# Altium project AutomatskoOsvetljenje.PrjPcb
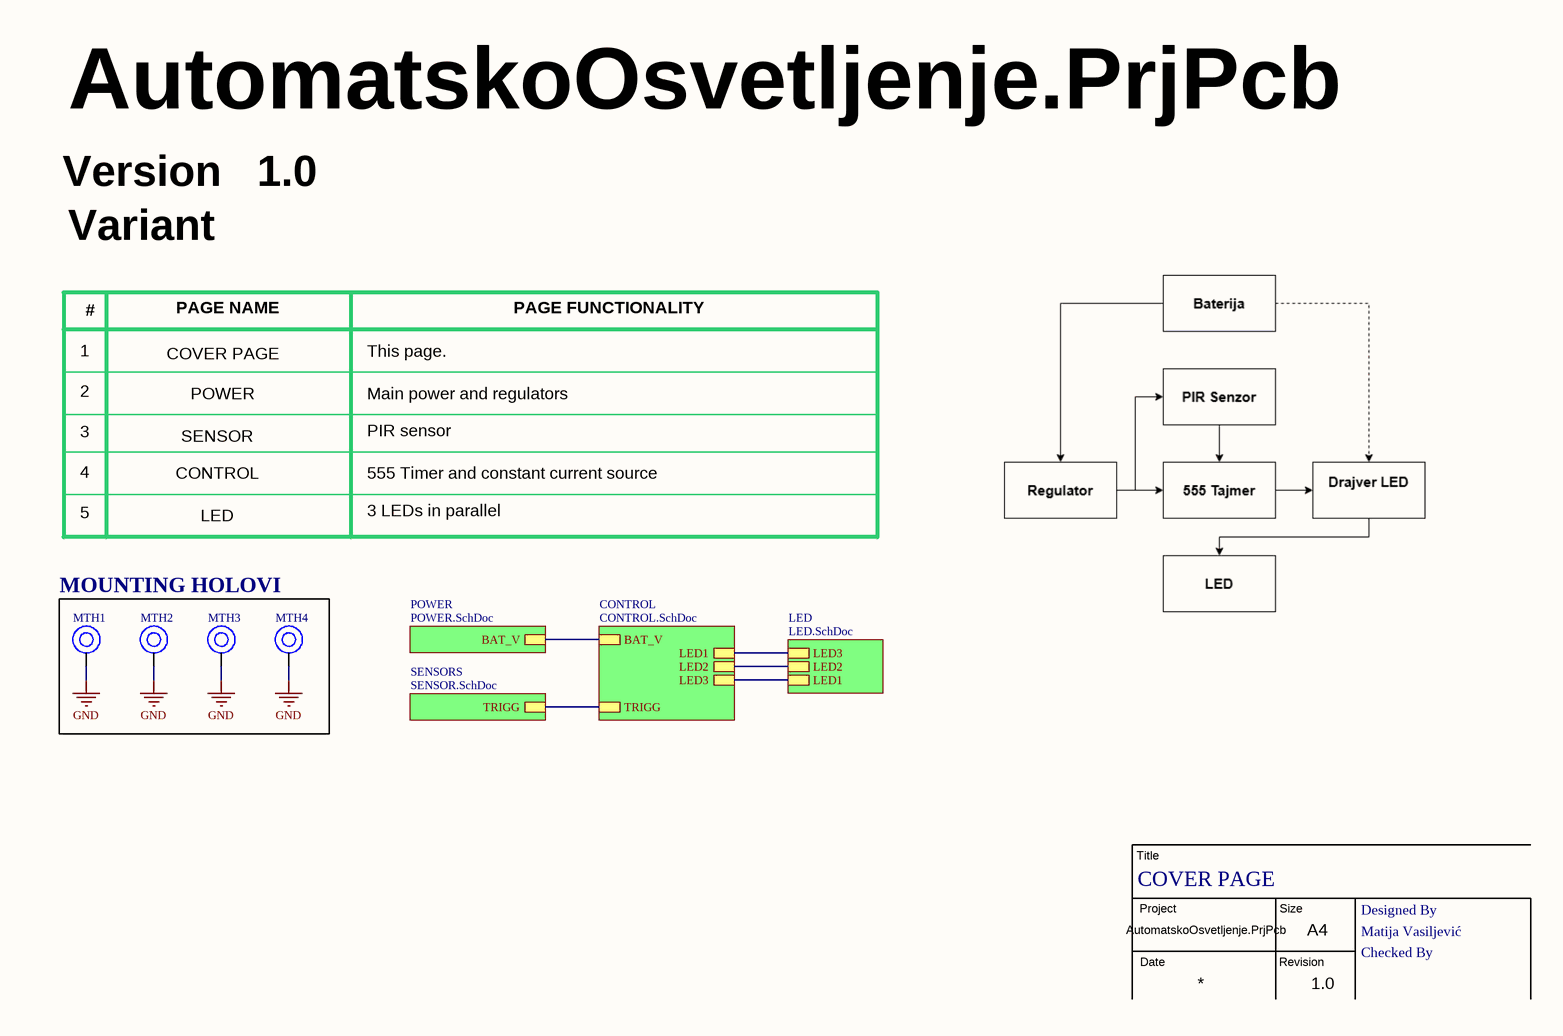
[diagram p0: COVER PAGE.SchDoc]
Engineer_Name: Matija Vasiljević; Global_version: 1.0
5 sheets, 69 parts. Net scope: hierarchical (ports join the sheet entries above them; power ports are global).
Board file: AutomatskoOsetljenjeV2.PcbDoc
Sheets:
  COVER PAGE.SchDoc
    CONTROL = CONTROL.SchDoc
    LED = LED.SchDoc
    POWER = POWER.SchDoc
    SENSORS = SENSOR.SchDoc

## Sheet COVER PAGE.SchDoc: COVER PAGE
size A4; SheetNumber: 1; SheetTotal: 5

### Parts
MTH1  MTH  [MOUNTING_HOLE_M3]  (value not drawn)  (no BOM)
MTH2  MTH  [MOUNTING_HOLE_M3]  (value not drawn)  (no BOM)
MTH3  MTH  [MOUNTING_HOLE_M3]  (value not drawn)  (no BOM)
MTH4  MTH  [MOUNTING_HOLE_M3]  (value not drawn)  (no BOM)

### Blocks framed on the sheet
MOUNTING HOLOVI: MTH1-MTH4

### Sub-sheets
CONTROL = CONTROL.SchDoc: BAT_V, TRIGG, LED1, LED2, LED3
LED = LED.SchDoc: LED1, LED2, LED3
POWER = POWER.SchDoc: BAT_V
SENSORS = SENSOR.SchDoc: TRIGG

### Nets
GND: MTH1.1 MTH2.1 MTH3.1 MTH4.1
NetLED3_2: sheet CONTROL/LED1, sheet LED/LED3
NetLED4_2: sheet CONTROL/LED2, sheet LED/LED2
NetLED5_2: sheet CONTROL/LED3, sheet LED/LED1
NetQ1_3: sheet CONTROL/TRIGG, sheet SENSORS/TRIGG
NetR11_2: sheet CONTROL/BAT_V, sheet POWER/BAT_V

### Notes on the sheet
- Variant
- Version
- #
- PAGE NAME
- PAGE FUNCTIONALITY
- 1
- COVER PAGE
- This page.
- 2
- 3
- SENSOR
- POWER
- Main power and regulators
- PIR sensor
- 4
- 5
- CONTROL
- LED
- 555 Timer and constant current source
- 3 LEDs in parallel
- Title
- Project
- Size
- Designed By
- Date
- Revision
- A4
- Checked By

### Library data of the parts
MTH1-MTH4 = MTH: Mounting hole; MPN: *

## Sheet CONTROL.SchDoc: CONTROL
size A4; SheetNumber: 4; SheetTotal: 5
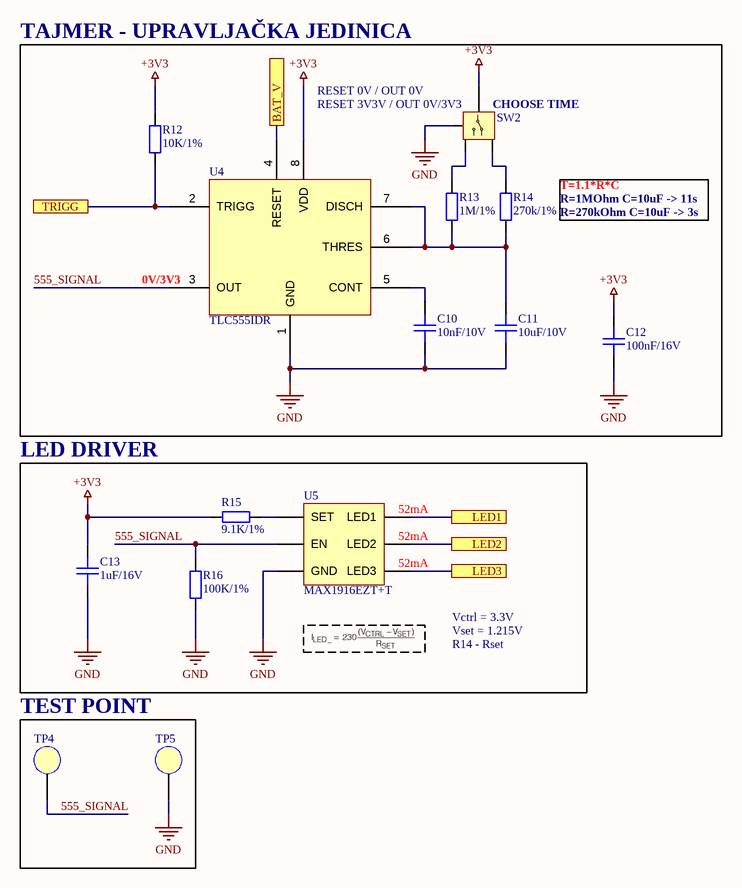
[diagram p1: CONTROL.SchDoc]

### Parts
C10  10nF/10V  [CAP_0603]
C11  10uF/10V  [CAP_0603]
C12  100nF/16V  [CAP_0603]
C13  1uF/16V  [CAP_0603]
R12  10K/1%  [RES_0603]
R13  1M/1%  [RES_0603]
R14  270k/1%  [RES_0603]
R15  9.1K/1%  [RES_0603]
R16  100K/1%  [RES_0603]
SW2  SWITCH_MAIN  [SWITCH_SK-12F17-G_HORIZONTAL]  (value not drawn)
TP4  TESTPOINT  [TESTPOINT]  (value not drawn)
TP5  TESTPOINT  [TESTPOINT]  (value not drawn)
U4  TLC555IDR  [8-SOIC]
U5  MAX1916EZT+T  [SOT23-6]

### Blocks framed on the sheet
TAJMER - UPRAVLJAČKA JEDINICA: C10-C12 R12-R14 SW2 U4
LED DRIVER: C13 R15 R16 U5
TEST POINT: TP4 TP5

### Ports
BAT_V, LED1, LED2, LED3, TRIGG

### Nets
+3V3: C12.2 C13.2 R12.2 R15.1 SW2.1(1P) U4.8(VDD)
GND: C10.1 C11.1 C12.1 C13.1 R16.1 SW2.4(GND) TP5.1(TP) U4.1(GND) U5.2(GND)
555_SIGNAL: R16.2 TP4.1(TP) U4.3(OUT) U5.1(EN)
NetC10_2: C10.2 U4.5(CONT)
NetC11_2: C11.2 R13.1 R14.1 U4.6(THRES) U4.7(DISCH)
NetLED3_2: U5.6(LED1) ; port LED1
NetLED4_2: U5.5(LED2) ; port LED2
NetLED5_2: U5.4(LED3) ; port LED3
NetQ1_3: R12.1 U4.2(TRIGG) ; port TRIGG
NetR11_2: U4.4(RESET) ; port BAT_V
NetR13_2: R13.2 SW2.2(2T)
NetR14_2: R14.2 SW2.3(3T)
NetR15_2: R15.2 U5.3(SET)

### Notes on the sheet
- (near SW2) RESET 0V / OUT 0V
- (near SW2) RESET 3V3V / OUT 0V/3V3
- (near SW2) CHOOSE TIME
- T=1.1*R*C
- R=1MOhm C=10uF -> 11s
- R=270kOhm C=10uF -> 3s
- (near U4) 0V/3V3
- (near U5) 52mA
- Vctrl = 3.3V
- Vset = 1.215V
- R14 - Rset
- Title
- Project
- Size
- Designed By
- Date
- Revision
- A4
- Checked By

### Library data of the parts
C10 = 10nF/10V: 10000 pF ±10% 50V Ceramic Capacitor X7R 0603 (1608 Metric); MPN: 0603B103K500CT
C11 = 10uF/10V: 10 µF ±10% 10V Ceramic Capacitor X5R 0603 (1608 Metric); MPN: CL10A106KP8NNNC
C12 = 100nF/16V: 0.1 µF ±10% 16V Ceramic Capacitor X7R 0603 (1608 Metric); MPN: CC0603KRX7R7BB104
C13 = 1uF/16V: 1 µF ±5% 16V Ceramic Capacitor X7R 0603 (1608 Metric); MPN: 0603YC105JAT2A
R12 = 10K/1%: 10 kOhms ±1% 0.1W, 1/10W Chip Resistor 0603 (1608 Metric) Moisture Resistant Thick Film; MPN: CR0603-FX-1002ELF
R13 = 1M/1%: 1 MOhms ±1% 0.1W, 1/10W Chip Resistor 0603 (1608 Metric) Automotive AEC-Q200 Thick Film; MPN: RMCF0603FT1M00
R14 = 270k/1%: 270 kOhms ±1% 0.1W, 1/10W Chip Resistor 0603 (1608 Metric) Automotive AEC-Q200 Thick Film; MPN: ERJ-3EKF2703V
R15 = 9.1K/1%: 9.1 kOhms ±1% 0.1W, 1/10W Chip Resistor 0603 (1608 Metric) Thick Film; MPN: CRCW06039K10FKEAC
R16 = 100K/1%: 100 kOhms ±1% 0.1W, 1/10W Chip Resistor 0603 (1608 Metric) Automotive AEC-Q200 Thick Film; MPN: ERJ-3EKF1003V
SW2 = SWITCH_MAIN: SWITCH SLIDE SPDT 300MA 30V; MPN: SK-12F17-G 7
TP4 TP5 = TESTPOINT: White PC Test Point, Miniature Phosphor Bronze Silver Plating Through Hole Mounting Type; MPN: 5002
U4 = TLC555IDR: 555 Type, Timer/Oscillator (Single) IC 2.1MHz 8-SOIC; MPN: TLC555IDR
U5 = LED DRIVER MAX1916: LED Driver IC 3 Output Linear Dimming 60mA TSOT-23-6; MPN: MAX1916EZT+T

## Sheet LED.SchDoc: LED
size A4; SheetNumber: 5; SheetTotal: 5
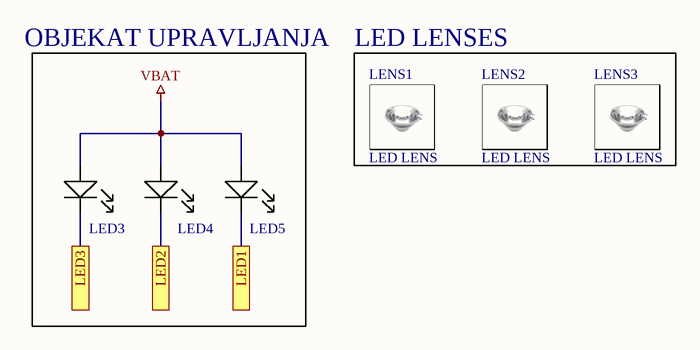
[diagram p2: LED.SchDoc]

### Parts
LED3  JB2835BWT-N-U65EA0000-N000P001  [LED_1411]  (value not drawn)
LED4  JB2835BWT-N-U65EA0000-N000P001  [LED_1411]  (value not drawn)
LED5  JB2835BWT-N-U65EA0000-N000P001  [LED_1411]  (value not drawn)
LENS1  LED LENS  (net tie)
LENS2  LED LENS  (net tie)
LENS3  LED LENS  (net tie)

### Blocks framed on the sheet
LED LENSES: LENS1-LENS3

### Ports
LED1, LED2, LED3

### Nets
VBAT: LED3.1(Anode) LED4.1(Anode) LED5.1(Anode)
NetLED3_2: LED3.2(Cathode) ; port LED3
NetLED4_2: LED4.2(Cathode) ; port LED2
NetLED5_2: LED5.2(Cathode) ; port LED1

### Notes on the sheet
- OBJEKAT UPRAVLJANJA
- Title
- Project
- Size
- Designed By
- Date
- Revision
- A4
- Checked By

### Library data of the parts
LED3-LED5 = LED COOL WHITE: LED Lighting J White, Cool 6500K 3-Step MacAdam Ellipse 2.7V 55mA 120° 1411 (3528 Metric); MPN: JB2835BWT-N-U65EA0000-N000P001
LENS1-LENS3 = LED LENS: LENS CLR 15-33DEG MEDIUM SNAP-IN; MPN: 10003/15

## Sheet POWER.SchDoc: POWER
size A4; SheetNumber: 2; SheetTotal: 5
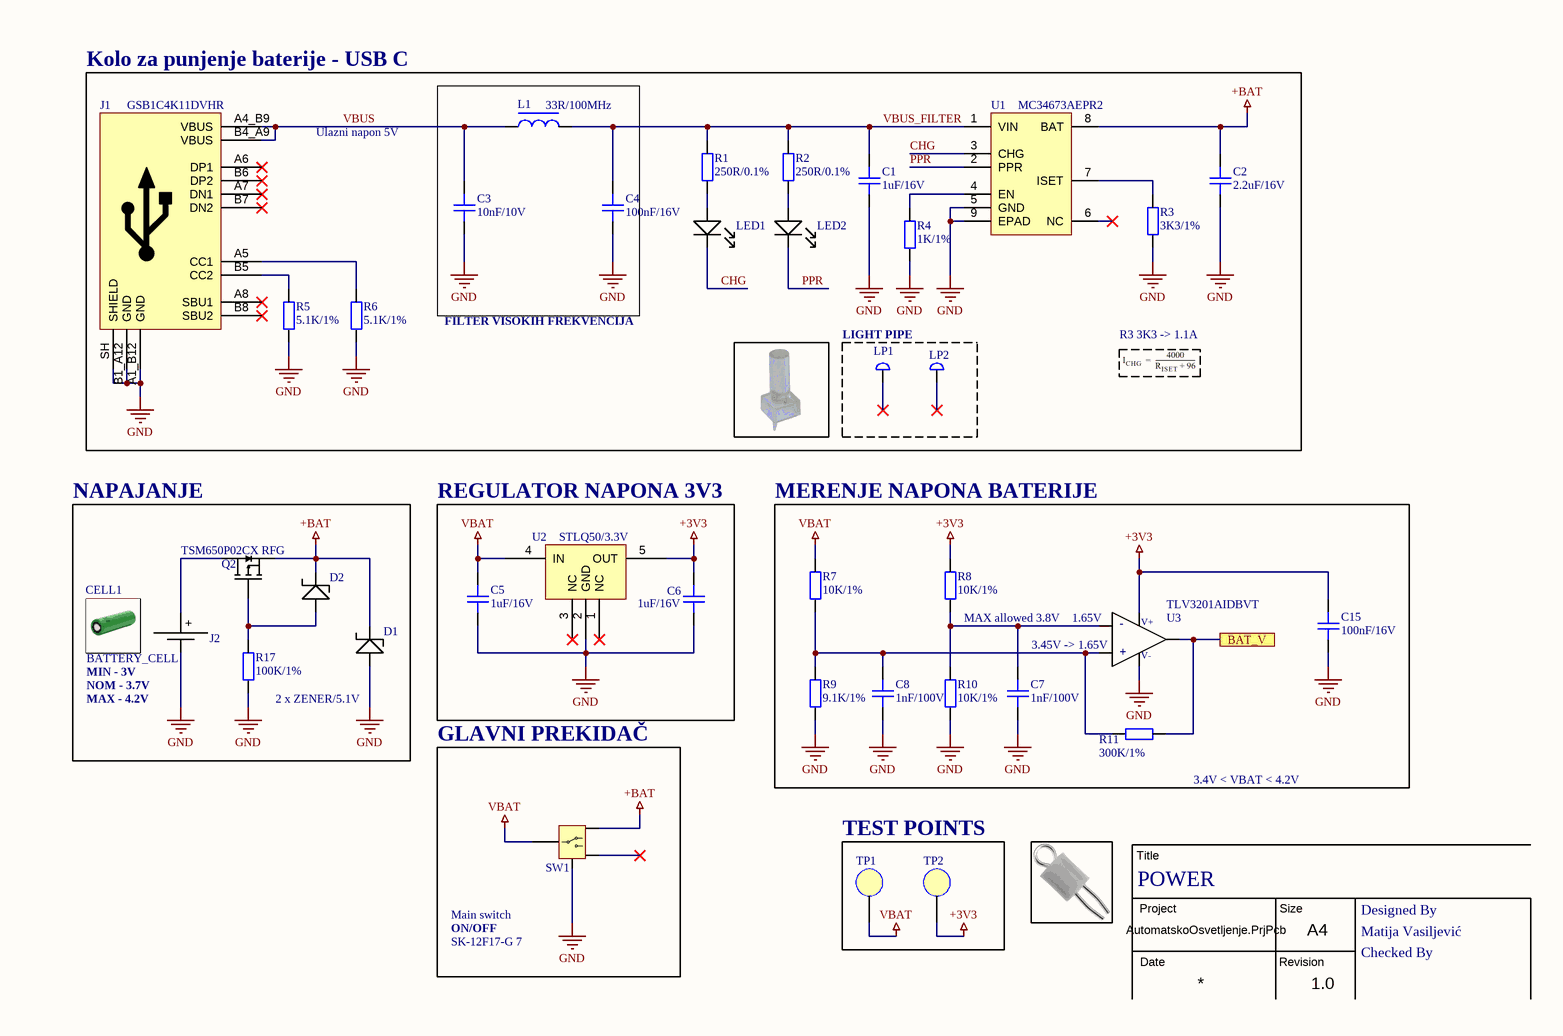
[diagram p3: POWER.SchDoc]

### Parts
C1  1uF/16V  [CAP_0603]
C2  2.2uF/16V  [CAP_0603]
C3  10nF/10V  [CAP_0603]
C4  100nF/16V  [CAP_0603]
C5  1uF/16V  [CAP_0603]
C6  1uF/16V  [CAP_0603]
C7  1nF/100V  [CAP_0603]
C8  1nF/100V  [CAP_0603]
C15  100nF/16V  [CAP_0603]
CELL1  BATTERY_CELL  (mechanical)
D1  ZENER/5.1V  [ZENER_SMA]  (value not drawn)
D2  2 x ZENER/5.1V  [ZENER_SMA]
J1  GSB1C4K11DVHR  [USBC_GSB1C4K11DVHR]
J2  12BHC186CLP-GR  [BATTERY_HOLDER_18650]  (value not drawn)
L1  33R/100MHz  [INDC_0603]
LED1  150060RS75000  [LED_0603]  (value not drawn)
LED2  150060VS75000  [LED_0603]  (value not drawn)
LP1  LIGHT_PIPE  [LIGHT_PIPE_VLP-400-F]  (value not drawn)
LP2  LIGHT_PIPE  [LIGHT_PIPE_VLP-400-F]  (value not drawn)
Q2  TSM650P02CX RFG  [SOT23-3]
R1  250R/0.1%  [RES_0603]
R2  250R/0.1%  [RES_0603]
R3  3K3/1%  [RES_0603]
R4  1K/1%  [RES_0603]
R5  5.1K/1%  [RES_0603]
R6  5.1K/1%  [RES_0603]
R7  10K/1%  [RES_0603]
R8  10K/1%  [RES_0603]
R9  9.1K/1%  [RES_0603]
R10  10K/1%  [RES_0603]
R11  300K/1%  [RES_0603]
R17  100K/1%  [RES_0603]
SW1  SK-12F17-G 7  [SWITCH_SK-12F17-G_HORIZONTAL]
TP1  TESTPOINT  [TESTPOINT]  (value not drawn)
TP2  TESTPOINT  [TESTPOINT]  (value not drawn)
U1  MC34673AEPR2  [UDFN 8]
U2  STLQ50/3.3V  [SOT323-5]
U3  TLV3201AIDBVT  [SOT23-5]

### Blocks framed on the sheet
Kolo za punjenje baterije - USB C: C1-C4 J1 L1 LED1 LED2 R1-R6 U1
LIGHT PIPE: LP1 LP2
NAPAJANJE: CELL1 D1 D2 J2 Q2 R17
REGULATOR NAPONA 3V3: C5 C6 U2
MERENJE NAPONA BATERIJE: C7 C8 C15 R7-R11 U3
GLAVNI PREKIDAČ: SW1
TEST POINTS: TP1 TP2

### Ports
BAT_V

### Nets
+3V3: C6.2 C15.2 R8.2 TP2.1(TP) U2.5(OUT) U3.5(+VDD)
+BAT: C2.2 D1.2(Cathode) D2.2(Cathode) Q2.2 SW1.3(3T) U1.8(BAT)
GND: C1.1 C2.1 C3.1 C4.1 C5.1 C6.1 C7.1 C8.1 C15.1 D1.1(Anode) J1.A1_B12(GND) J1.B1_A12(GND) J1.SH(SHIELD) J2.2(-) R3.1 R4.1 R5.1 R6.1 R9.1 R10.1 R17.1 SW1.4(GND) U1.5(GND) U1.9(EPAD) U2.2(GND) U3.2(-VDD)
VBAT: C5.2 R7.2 SW1.1(1P) TP1.1(TP) U2.4(IN)
CHG: LED1.2(Cathode) U1.3(CHG)
PPR: LED2.2(Cathode) U1.2(PPR)
VBUS: C3.2 J1.A4_B9(VBUS) J1.B4_A9(VBUS) L1.1
VBUS_FILTER: C1.2 C4.2 L1.2 R1.2 R2.2 U1.1(VIN)
NetC7_2: C7.2 R8.1 R10.2 U3.4(-)
NetC8_2: C8.2 R7.1 R9.2 R11.1 U3.3(+)
NetD2_1: D2.1(Anode) Q2.1 R17.2
NetJ1_A5: J1.A5(CC1) R6.2
NetJ1_B5: J1.B5(CC2) R5.2
NetJ2_1: J2.1(+) Q2.3
NetLED1_1: LED1.1(Anode) R1.1
NetLED2_1: LED2.1(Anode) R2.1
NetR3_2: R3.2 U1.7(ISET)
NetR4_2: R4.2 U1.4(EN)
NetR11_2: R11.2 U3.1(OUT) ; port BAT_V

Not connected (* = marked no-connect by the designer): J1 A6(DP1)* A7(DN1)* A8(SBU1)* B6(DP2)* B7(DN2)* B8(SBU2)*; LP1 1*; LP2 1*; SW1 2(2T)*; U1 6(NC)*; U2 1(NC)* 3(NC)*

### Notes on the sheet
- Ulazni napon 5V
- FILTER VISOKIH FREKVENCIJA
- R3 3K3 -> 1.1A
- (near R8) MAX allowed 3.8V
- (near U3) 3.45V -> 1.65V
- (near U3) 1.65V
- MIN - 3V
- NOM - 3.7V
- MAX - 4.2V
- 3.4V < VBAT < 4.2V
- Main switch
- ON/OFF
- Title
- Project
- Size
- Designed By
- Date
- Revision
- A4
- Checked By
- (in symbol TLV3201AIDBVT_COMPARATOR) V+; V-

### Library data of the parts
C1 C5 C6 = 1uF/16V: as C13 on sheet CONTROL
C2 = 2.2uF/16V: 2.2 µF ±10% 16V Ceramic Capacitor X7S 0603 (1608 Metric); MPN: GRM188C71C225KE11D
C3 = 10nF/10V: as C10 on sheet CONTROL
C4 C15 = 100nF/16V: as C12 on sheet CONTROL
C7 C8 = 1nF/100V: 1 µF ±10% 10V Ceramic Capacitor X7R 0603 (1608 Metric); MPN: CL10B105KP8NNNC
CELL1 = BATTERY_CELL: CELL 18650 SAMSUNG 3200mAh; MPN: *
D1 D2 = ZENER/5.1V: Zener Diode 5.1 V 1.5 W ±5% Surface Mount SMA; MPN: 1SMA5918BT3G
J1 = USB_C_GSB1C4K11DVHR: USB-C (USB TYPE-C) USB 2.0 Receptacle Connector 24 (16+8 Dummy) Position Through Hole, Right Angle; MPN: GSB1C4K11DVHR
J2 = BATTERY_HOLDER_18650: Cylindrical Battery Contacts, Clips, Holders & Springs 18650 Holder Board Mount Clip; MPN: 12BHC186CLP-GR
L1 = 33R/100MHz: 33 Ohms @ 100 MHz 1 Power Line Ferrite Bead 0603 (1608 Metric) 3A 25mOhm; MPN: BLM18PG330SN1DBLM18PG330SN1D
LED1 = INDICATION_LED_RED_1500_1: Red 625nm LED Indication - Discrete 2V 0603 (1608 Metric); MPN: 150060RS75000
LED2 = INDICATION_LED_GREEN_1500: Green 570nm LED Indication - Discrete 2V 0603 (1608 Metric); MPN: 150060VS75000
LP1 LP2 = LIGHT_PIPE: Light pipe for indication led; MPN: VLP-400-F
Q2 = TSM650P02CX RFG PMOS: P-Channel 20 V 4.1A (Tc) 1.56W (Tc) Surface Mount SOT-23; MPN: TSM650P02CX RFG
R1 R2 = 250R/0.1%: 250 Ohms ±0.1% 0.1W, 1/10W Chip Resistor 0603 (1608 Metric) Thin Film; MPN: RT0603BRE07250RL
R3 = 3K3/1%: 3.3 kOhms ±1% 0.1W, 1/10W Chip Resistor 0603 (1608 Metric) Automotive AEC-Q200 Thick Film; MPN: RMCF0603FT3K30
R4 = 1K/1%: 1 kOhms ±1% 0.1W, 1/10W Chip Resistor 0603 (1608 Metric) Moisture Resistant Thick Film; MPN: RC0603FR-071KL
R5 R6 = 5.1K/1%: 5.1 kOhms ±1% 0.1W, 1/10W Chip Resistor 0603 (1608 Metric) Moisture Resistant Thick Film; MPN: RC0603FR-075K1L
R7 R8 R10 = 10K/1%: as R12 on sheet CONTROL
R9 = 9.1K/1%: as R15 on sheet CONTROL
R11 = 300K/1%: 300 kOhms ±1% 0.1W, 1/10W Chip Resistor 0603 (1608 Metric) Automotive AEC-Q200 Thick Film; MPN: RMCF0603FT300K
R17 = 100K/1%: as R16 on sheet CONTROL
SW1 = SWITCH_MAIN: SWITCH SLIDE SPDT 300MA 30V; MPN: SK-12F17-G 7
TP1 TP2 = TESTPOINT: as TP4 on sheet CONTROL
U1 = MC34673AEPR2: Charger IC Lithium Ion/Polymer 8-UDFN (3x2); MPN: MC34673AEPR2
U2 = REG-STLQ50/3.3V: IC REG LINEAR 3.3V 50MA SOT323-5; MPN: STLQ50C33R
U3 = TLV3201AIDBVT_COMPARATOR: Comparator General Purpose Push-Pull SOT-23-5; MPN: TLV3201AIDBVT

## Sheet SENSOR.SchDoc: SENSOR
size A4; SheetNumber: 3; SheetTotal: 5
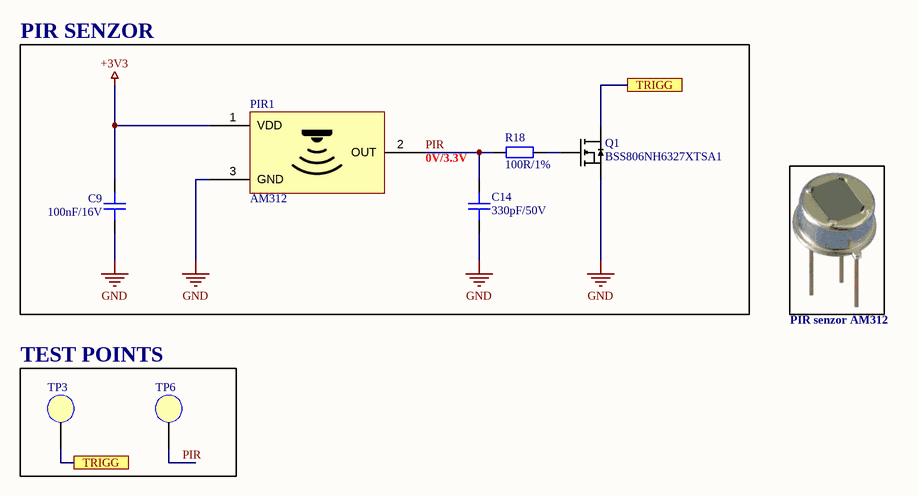
[diagram p4: SENSOR.SchDoc]

### Parts
C9  100nF/16V  [CAP_0603]
C14  330pF/50V  [CAP_0603]
PIR1  AM312  [AM312]
Q1  BSS806NH6327XTSA1  [SOT23-3]
R18  100R/1%  [RES_0603]
TP3  TESTPOINT  [TESTPOINT]  (value not drawn)
TP6  TESTPOINT  [TESTPOINT]  (value not drawn)

### Blocks framed on the sheet
PIR SENZOR: C9 C14 PIR1 Q1 R18
TEST POINTS: TP3 TP6

### Ports
TRIGG

### Nets
+3V3: C9.2 PIR1.1(VDD)
GND: C9.1 C14.1 PIR1.3(GND) Q1.2
PIR: C14.2 PIR1.2(OUT) R18.1 TP6.1(TP)
NetQ1_1: Q1.1 R18.2
NetQ1_3: Q1.3 TP3.1(TP) ; port TRIGG

### Notes on the sheet
- 0V/3.3V
- PIR senzor AM312
- Title
- Project
- Size
- Designed By
- Date
- Revision
- A4
- Checked By

### Library data of the parts
C9 = 100nF/16V: as C12 on sheet CONTROL
C14 = 330pF/50V: 330 pF ±10% 50V Ceramic Capacitor X7R 0603 (1608 Metric); MPN: C0603C331K5RACTU
PIR1 = AM312: AM312 PIR sensor; ComponentLink1Description: MPN; ComponentLink1URL: RAK12006-0-WB-N
Q1 = BSS806NH6327XTSA1_NMOS: N-Channel 20 V 2.3A (Ta) 500mW (Ta) Surface Mount PG-SOT23; MPN: BSS806NH6327XTSA1
R18 = 100R/1%: 100 Ohms ±1% 0.1W, 1/10W Chip Resistor 0603 (1608 Metric) Automotive AEC-Q200 Thick Film; MPN: ERJ-3EKF1000V
TP3 TP6 = TESTPOINT: as TP4 on sheet CONTROL

## Nets that join several sheets
+3V3: CONTROL (6 pins), POWER (6 pins), SENSOR (C9.2 PIR1.1)
GND: COVER PAGE (MTH1.1 MTH2.1 MTH3.1 MTH4.1), CONTROL (9 pins), POWER (26 pins), SENSOR (C9.1 C14.1 PIR1.3 Q1.2)
VBAT: LED (LED3.1 LED4.1 LED5.1), POWER (5 pins)
NetLED3_2: CONTROL (U5.6), LED (LED3.2)
NetLED4_2: CONTROL (U5.5), LED (LED4.2)
NetLED5_2: CONTROL (U5.4), LED (LED5.2)
NetQ1_3: CONTROL (R12.1 U4.2), SENSOR (Q1.3 TP3.1)
NetR11_2: CONTROL (U4.4), POWER (R11.2 U3.1)